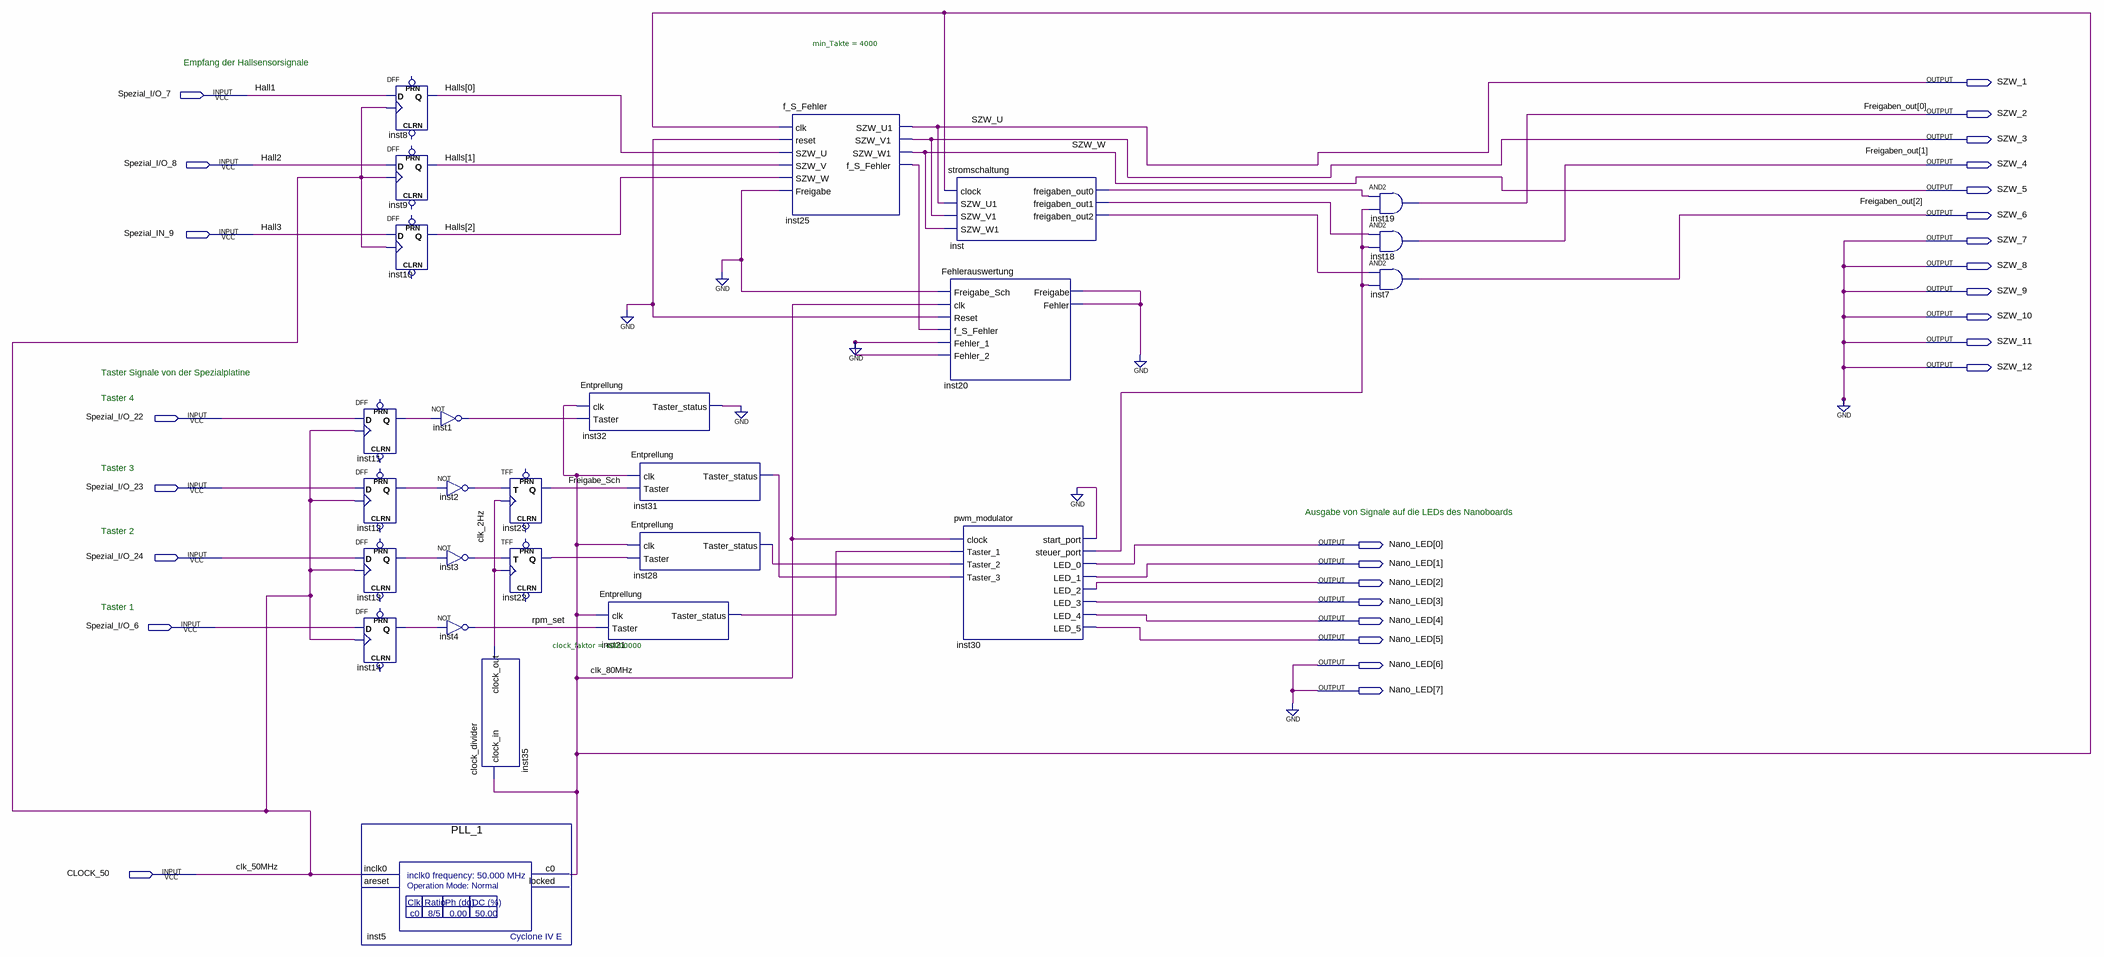
[diagram p0: schematic sheet]
// Quartus schematic Teamarbeit_Vorlage.bdf as structural Verilog: 26 symbols, 28 pins
module Teamarbeit_Vorlage (
  input  \Spezial_I/O_7 ,
  input  \Spezial_I/O_8 ,
  input  Spezial_IN_9,
  input  \Spezial_I/O_22 ,
  input  \Spezial_I/O_23 ,
  input  \Spezial_I/O_24 ,
  input  \Spezial_I/O_6 ,
  input  CLOCK_50,
  output SZW_1,
  output SZW_2,
  output SZW_3,
  output SZW_4,
  output SZW_5,
  output SZW_6,
  output SZW_7,
  output SZW_8,
  output SZW_9,
  output SZW_10,
  output SZW_11,
  output SZW_12,
  output [7:0] Nano_LED
);

  wire clk_2Hz, clk_80MHz, Freigabe_Sch, inst1_out, inst2_out, inst3_out, inst11_q, inst12_q, inst13_q,
       inst14_q, inst20_freigabe, inst21_taster_status, inst22_q, inst25_f_s_fehler, inst28_taster_status,
       inst30_start_port, inst30_steuer_port, inst31_taster_status, inst32_taster_status,
       inst_freigaben_out0, inst_freigaben_out1, inst_freigaben_out2, rpm_set;
  wire [2:0] Halls;

  DFF inst11 (.CLK(CLOCK_50), .D(\Spezial_I/O_22 ), .Q(inst11_q));  // open: CLRN, PRN
  DFF inst12 (.CLK(CLOCK_50), .D(\Spezial_I/O_23 ), .Q(inst12_q));  // open: CLRN, PRN
  DFF inst13 (.CLK(CLOCK_50), .D(\Spezial_I/O_24 ), .Q(inst13_q));  // open: CLRN, PRN
  DFF inst14 (.CLK(CLOCK_50), .D(\Spezial_I/O_6 ), .Q(inst14_q));  // open: CLRN, PRN
  PLL_1 inst5 (.inclk0(CLOCK_50), .c0(clk_80MHz));  // open: areset, locked
  DFF inst8 (.CLK(CLOCK_50), .D(\Spezial_I/O_7 ), .Q(Halls[0]));  // open: CLRN, PRN
  DFF inst9 (.CLK(CLOCK_50), .D(\Spezial_I/O_8 ), .Q(Halls[1]));  // open: CLRN, PRN
  DFF inst10 (.CLK(CLOCK_50), .D(Spezial_IN_9), .Q(Halls[2]));  // open: CLRN, PRN
  not inst1 (inst1_out, inst11_q);
  not inst2 (inst2_out, inst12_q);
  not inst3 (inst3_out, inst13_q);
  not inst4 (rpm_set, inst14_q);
  clock_divider #(.clock_faktor(40000000)) inst35 (.clock_in(clk_80MHz), .clock_out(clk_2Hz));
  TFF inst23 (.T(inst2_out), .CLK(clk_2Hz), .Q(Freigabe_Sch));  // open: PRN, CLRN
  TFF inst22 (.T(inst3_out), .CLK(clk_2Hz), .Q(inst22_q));  // open: PRN, CLRN
  Entprellung inst32 (.clk(clk_80MHz), .Taster(inst1_out), .Taster_status(inst32_taster_status));
  Entprellung inst31 (.clk(clk_80MHz), .Taster(Freigabe_Sch), .Taster_status(inst31_taster_status));
  Entprellung inst28 (.clk(clk_80MHz), .Taster(inst22_q), .Taster_status(inst28_taster_status));
  Entprellung inst21 (.clk(clk_80MHz), .Taster(rpm_set), .Taster_status(inst21_taster_status));
  f_S_Fehler #(.min_Takte(4000)) inst25 (
    .clk(clk_80MHz), .reset(1'b0), .SZW_U(Halls[0]), .SZW_V(Halls[1]), .SZW_W(Halls[2]), .Freigabe(1'b0),
    .SZW_U1(SZW_1), .SZW_V1(SZW_3), .SZW_W1(SZW_5), .f_S_Fehler(inst25_f_s_fehler));
  stromschaltung inst (
    .clock(clk_80MHz), .SZW_U1(SZW_1), .SZW_V1(SZW_3), .SZW_W1(SZW_5), .freigaben_out0(inst_freigaben_out0),
    .freigaben_out1(inst_freigaben_out1), .freigaben_out2(inst_freigaben_out2));
  Fehlerauswertung inst20 (
    .Freigabe_Sch(1'b0), .clk(clk_80MHz), .Reset(1'b0), .f_S_Fehler(inst25_f_s_fehler), .Fehler_1(1'b0),
    .Fehler_2(1'b0), .Freigabe(inst20_freigabe), .Fehler(inst20_freigabe));
  pwm_modulator inst30 (
    .clock(clk_80MHz), .Taster_1(inst21_taster_status), .Taster_2(inst28_taster_status),
    .Taster_3(inst31_taster_status), .start_port(inst30_start_port), .steuer_port(inst30_steuer_port),
    .LED_0(Nano_LED[0]), .LED_1(Nano_LED[1]), .LED_2(Nano_LED[2]), .LED_3(Nano_LED[3]), .LED_4(Nano_LED[4]),
    .LED_5(Nano_LED[5]));
  and inst19 (SZW_2, inst_freigaben_out0, inst30_steuer_port);
  and inst18 (SZW_4, inst_freigaben_out1, inst30_steuer_port);
  and inst7 (SZW_6, inst_freigaben_out2, inst30_steuer_port);

  assign Nano_LED[7:6] = 2'b00;
  assign SZW_7 = 1'b0;
  assign SZW_8 = 1'b0;
  assign SZW_9 = 1'b0;
  assign SZW_10 = 1'b0;
  assign SZW_11 = 1'b0;
  assign SZW_12 = 1'b0;
  // also tied to GND on the sheet: {inst32_taster_status, inst30_start_port, inst20_freigabe}

  // Other names for the same wires on the sheet: clk_50MHz = CLOCK_50; Freigaben_out[2:0] = {SZW_6, SZW_4, SZW_2};
  //   Hall1 = \Spezial_I/O_7 ; Hall2 = \Spezial_I/O_8 ; Hall3 = Spezial_IN_9; SZW_U = SZW_1; SZW_W = SZW_5

  // Notes on the sheet:
  //   Empfang der Hallsensorsignale
  //   Taster Signale von der Spezialplatine
  //   Taster 4
  //   Taster 3
  //   Ausgabe von Signale auf die LEDs des Nanoboards
  //   Taster 2
  //   Taster 1
endmodule
